# Altium schematic sheet Power_Supply.SchDoc
size A4
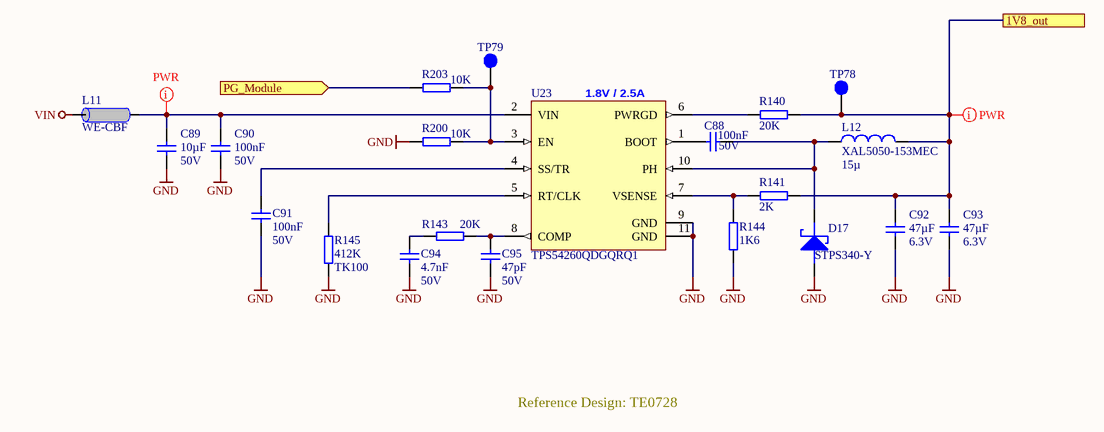
[diagram p0: Power_Supply.SchDoc]

## Parts
C88  100nF  Voltage: 50V  [CAPC1608X90N_FED]
C89  10µF  Voltage: 50V  [CAPC3216X180N_V]
C90  100nF  Voltage: 50V  [CAPC1608X90N_FED]
C91  100nF  Voltage: 50V  [CAPC1608X90N_FED]
C92  47µF  Voltage: 6.3V  [CAPC2012X135N_V]
C93  47µF  Voltage: 6.3V  [CAPC2012X135N_V]
C94  4.7nF  Voltage: 50V  [CAPC1608X90N_FED]
C95  47pF  Voltage: 50V  [CAPC1608X90N_FED]
D17  STPS340-Y  [DIOM5336X265N]
L11  WE-CBF  [INDC2012X92N_V]
L12  XAL5050-153MEC  value 15µ  [IND_XAL5050]
R140  20K  [RESC1608X55N_FED]
R141  2K  [RESC1608X55N_FED]
R143  20K  [RESC1608X55N_FED]
R144  1K6  [RESC1608X55N_FED]
R145  412K  Technology: TK100  [RESC1608X55N_FED]
R200  10K  [RESC1608X55N_FED]
R203  10K  [RESC1608X55N_FED]
TP78  Testpoint 1mm  [TP_1mm]  (value not drawn)
TP79  Testpoint 1mm  [TP_1mm]  (value not drawn)
U23  TPS54260QDGQRQ1  [TSSOP50P490X110-11N-TI-DGQ]

## Ports
1V8_out, PG_Module (in)

## Nets
GND: C89.2 C90.1 C91.1 C92.1 C93.1 C94.2 C95.2 D17.2(ANODE) R144.2 R145.2 R200.1 U23.9(GND) U23.11(GND)
VIN: L11.2
1V8_out: C92.2 C93.2 L12.2 R140.1 R141.1 TP78.1 ; port 1V8_out
PG_Module: R203.1 ; port PG_Module
NetC88_1: C88.1 D17.1(KATHODE) L12.1 U23.10(PH)
NetC88_2: C88.2 U23.1(BOOT)
NetC89_1: C89.1 C90.2 L11.1 U23.2(VIN)
NetC91_2: C91.2 U23.4(SS/TR)
NetC94_1: C94.1 R143.2
NetC95_1: C95.1 R143.1 U23.8(COMP)
NetR140_2: R140.2 U23.6(PWRGD)
NetR141_2: R141.2 R144.1 U23.7(VSENSE)
NetR145_1: R145.1 U23.5(RT/CLK)
NetR200_2: R200.2 R203.2 TP79.1 U23.3(EN)

## Layout directives
net class PWR: 1V8_out, NetC89_1

## Notes on the sheet
- (near U23) 1.8V / 2.5A
- Reference Design: TE0728

## Library data of the parts
C88 C90 C91 = 21382: KON 100nF 50V X7R ±10% SMD BF 1608 (0603); Value: 100n; AN: 21382; Mixed: SMT; Preferred: Yes; Temperature-Range: -55/+125; Tolerance: ±10%; Technology: X7R; Case: 1608 (0603)
C89 = 24685: KON 10µF 50V X5R 10%  SMD BF 3216 (1206); Value: 10u; AN: 24685; Mixed: SMT; Temperature-Range: -55/+85; Preferred: Yes; Technology: X5R; Case: 3216 (1206); Tolerance: 10%
C92 C93 = 24718: KON 47µF 6,3V X5R 20% SMD BF 2012 (0805); Value: 47u; AN: 24718; Mixed: SMT; Preferred: Yes; H-ART: CC0805MKX5R5BB476; Temperature-Range: -55/+85; Tolerance: 20%; Technology: X5R; Case: 2012 (0805)
C94 = 29638: KON 4.7nF 50V NP0 ±5%  SMD BF 1608 (0603); Value: 4.7n; AN: 29638; Mixed: SMT; Tolerance: ±5%; Technology: NP0; Case: 1608 (0603)
C95 = 25942: KON 47pF 50V NP0 5%  SMD BF 1608 (0603); Value: 47p; AN: 25942; Mixed: SMT; Preferred: Yes; Tolerance: 5%; Technology: NP0; Case: 1608 (0603)
D17 = 26110: STPS340-UY; AN: 26110; Voltage: 40V; Mixed: SMT; Extra: Automotive Schottky 40V 3A; Case: SMB; Technology: AEC-Q200; HelpURL: B:\AD\adlib\datasheet\STPS340-Y; H-ART: STPS340-UY
L11 = 24513: Ferritdurchführung SMD 0805; AN: 24513; Voltage: 2000mA; Mixed: SMT; Trenz-Stock: Yes; H-ART: 742792040; Extra: 0,15 Ohm DC, 600 Ohm bei 100MHz, 700 Ohm bei 150Mhz, 2000mA; Case: 2012 (0805); Technology: 0.15Ohm; HelpURL: B:\AD\adlib\datasheet\742792040
L12 = 26235: Power Inductor 15µH 20% 3.9A 76.7mOhms; AN: 26235; Mixed: SMT; Voltage: 3.9A 76.7mOhms; HelpURL: B:\AD\adlib\datasheet\xal50xx; H-ART: XAL5050-153MEC; Extra: XAL5050-153MEC
R140 R143 = 22538: WID SMD 20K 1% 0,1W; AN: 22538; Mixed: SMT; Extra: BF 1608 (0603); Value: 20K; Tolerance: 1%; Technology: TK100; Case: 1608 (0603)
R141 = 26105: WID SMD 2K 1% 0,1W AEC-Q200; AN: 26105; Mixed: SMT; Extra: BF 1608 (0603); Value: 2k; Tolerance: 1%; Technology: TK100; Case: 1608 (0603); HelpURL: B:\AD\adlib\datasheet\DCRCWe3
R144 = 26104: WID SMD 1K6 1% 0,1W AEC-Q200; Value: 1.6k; AN: 26104; Mixed: SMT; Extra: BF 1608 (0603); Tolerance: 1%; Technology: TK100; Case: 1608 (0603); HelpURL: B:\AD\adlib\datasheet\DCRCWe3
R145 = 26111: WID SMD 412K 1% 0,1W AEC-Q200; AN: 26111; Mixed: SMT; Preferred: Yes; Extra: BF 1608 (0603); Value: 412k; Tolerance: 1%; Case: 1608 (0603); HelpURL: B:\AD\adlib\datasheet\DCRCWe3
R200 R203 = 21492: WID SMD 10K 1% 0,1W; AN: 21492; Mixed: SMT; Preferred: Yes; Extra: BF 1608 (0603); Value: 10K; Tolerance: 1%; Case: 1608 (0603); Technology: TK100
TP78 TP79 = 25063: AN: 25063; Mixed: SMT
U23 = 26100: AN: 26100; Mixed: SMT; Trenz-Stock: Yes; Extra: Automotive Catalog 3.5V to 60V Input, 2.5A, 2.5MHz Step Down; Case: MSOP10 DGQ (S-PDSO-G10); Technology: AEC-Q200; HelpURL: B:\AD\adlib\datasheet\TPS54260; H-ART: TPS54260QDGQRQ1